# Altium schematic sheet panel2.SchDoc
size A
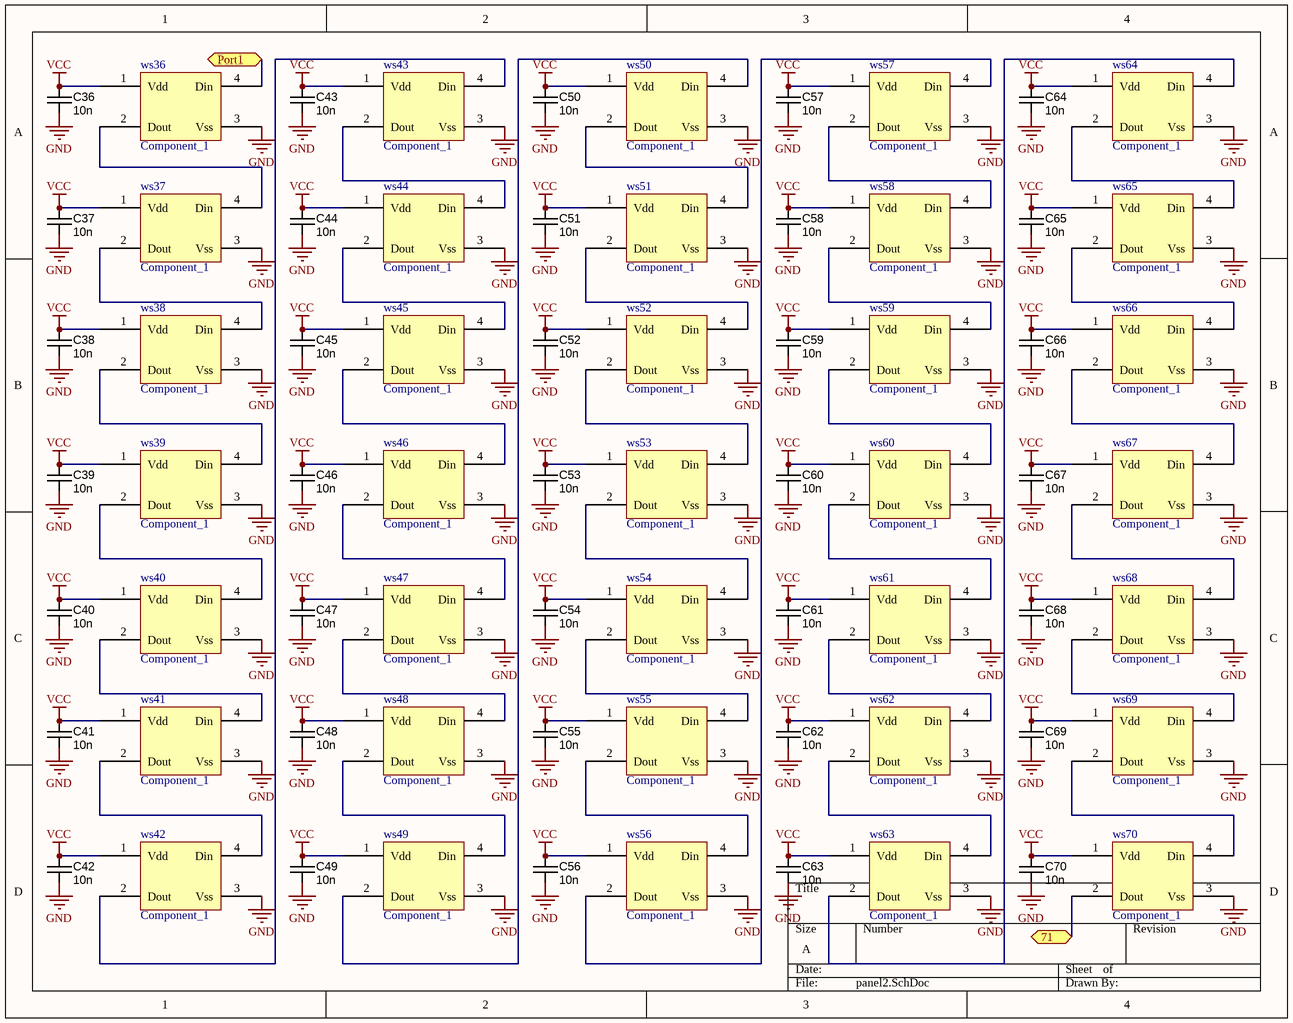
[diagram p0: panel2.SchDoc]

## Parts
C36  value 10n  [CAPC1608X90N]  (hidden comment: approved sub OK)
C37  value 10n  [CAPC1608X90N]  (hidden comment: approved sub OK)
C38  value 10n  [CAPC1608X90N]  (hidden comment: approved sub OK)
C39  value 10n  [CAPC1608X90N]  (hidden comment: approved sub OK)
C40  value 10n  [CAPC1608X90N]  (hidden comment: approved sub OK)
C41  value 10n  [CAPC1608X90N]  (hidden comment: approved sub OK)
C42  value 10n  [CAPC1608X90N]  (hidden comment: approved sub OK)
C43  value 10n  [CAPC1608X90N]  (hidden comment: approved sub OK)
C44  value 10n  [CAPC1608X90N]  (hidden comment: approved sub OK)
C45  value 10n  [CAPC1608X90N]  (hidden comment: approved sub OK)
C46  value 10n  [CAPC1608X90N]  (hidden comment: approved sub OK)
C47  value 10n  [CAPC1608X90N]  (hidden comment: approved sub OK)
C48  value 10n  [CAPC1608X90N]  (hidden comment: approved sub OK)
C49  value 10n  [CAPC1608X90N]  (hidden comment: approved sub OK)
C50  value 10n  [CAPC1608X90N]  (hidden comment: approved sub OK)
C51  value 10n  [CAPC1608X90N]  (hidden comment: approved sub OK)
C52  value 10n  [CAPC1608X90N]  (hidden comment: approved sub OK)
C53  value 10n  [CAPC1608X90N]  (hidden comment: approved sub OK)
C54  value 10n  [CAPC1608X90N]  (hidden comment: approved sub OK)
C55  value 10n  [CAPC1608X90N]  (hidden comment: approved sub OK)
C56  value 10n  [CAPC1608X90N]  (hidden comment: approved sub OK)
C57  value 10n  [CAPC1608X90N]  (hidden comment: approved sub OK)
C58  value 10n  [CAPC1608X90N]  (hidden comment: approved sub OK)
C59  value 10n  [CAPC1608X90N]  (hidden comment: approved sub OK)
C60  value 10n  [CAPC1608X90N]  (hidden comment: approved sub OK)
C61  value 10n  [CAPC1608X90N]  (hidden comment: approved sub OK)
C62  value 10n  [CAPC1608X90N]  (hidden comment: approved sub OK)
C63  value 10n  [CAPC1608X90N]  (hidden comment: approved sub OK)
C64  value 10n  [CAPC1608X90N]  (hidden comment: approved sub OK)
C65  value 10n  [CAPC1608X90N]  (hidden comment: approved sub OK)
C66  value 10n  [CAPC1608X90N]  (hidden comment: approved sub OK)
C67  value 10n  [CAPC1608X90N]  (hidden comment: approved sub OK)
C68  value 10n  [CAPC1608X90N]  (hidden comment: approved sub OK)
C69  value 10n  [CAPC1608X90N]  (hidden comment: approved sub OK)
C70  value 10n  [CAPC1608X90N]  (hidden comment: approved sub OK)
ws36  Component_1  [SOP4]
ws37  Component_1  [SOP4]
ws38  Component_1  [SOP4]
ws39  Component_1  [SOP4]
ws40  Component_1  [SOP4]
ws41  Component_1  [SOP4]
ws42  Component_1  [SOP4]
ws43  Component_1  [SOP4]
ws44  Component_1  [SOP4]
ws45  Component_1  [SOP4]
ws46  Component_1  [SOP4]
ws47  Component_1  [SOP4]
ws48  Component_1  [SOP4]
ws49  Component_1  [SOP4]
ws50  Component_1  [SOP4]
ws51  Component_1  [SOP4]
ws52  Component_1  [SOP4]
ws53  Component_1  [SOP4]
ws54  Component_1  [SOP4]
ws55  Component_1  [SOP4]
ws56  Component_1  [SOP4]
ws57  Component_1  [SOP4]
ws58  Component_1  [SOP4]
ws59  Component_1  [SOP4]
ws60  Component_1  [SOP4]
ws61  Component_1  [SOP4]
ws62  Component_1  [SOP4]
ws63  Component_1  [SOP4]
ws64  Component_1  [SOP4]
ws65  Component_1  [SOP4]
ws66  Component_1  [SOP4]
ws67  Component_1  [SOP4]
ws68  Component_1  [SOP4]
ws69  Component_1  [SOP4]
ws70  Component_1  [SOP4]

## Ports
71, Port1

## Nets
GND: C36.2 C37.2 C38.2 C39.2 C40.2 C41.2 C42.2 C43.2 C44.2 C45.2 C46.2 C47.2 C48.2 C49.2 C50.2 C51.2 C52.2 C53.2 C54.2 C55.2 C56.2 C57.2 C58.2 C59.2 C60.2 C61.2 C62.2 C63.2 C64.2 C65.2 C66.2 C67.2 C68.2 C69.2 C70.2 ws36.3(Vss) ws37.3(Vss) ws38.3(Vss) ws39.3(Vss) ws40.3(Vss) ws41.3(Vss) ws42.3(Vss) ws43.3(Vss) ws44.3(Vss) ws45.3(Vss) ws46.3(Vss) ws47.3(Vss) ws48.3(Vss) ws49.3(Vss) ws50.3(Vss) ws51.3(Vss) ws52.3(Vss) ws53.3(Vss) ws54.3(Vss) ws55.3(Vss) ws56.3(Vss) ws57.3(Vss) ws58.3(Vss) ws59.3(Vss) ws60.3(Vss) ws61.3(Vss) ws62.3(Vss) ws63.3(Vss) ws64.3(Vss) ws65.3(Vss) ws66.3(Vss) ws67.3(Vss) ws68.3(Vss) ws69.3(Vss) ws70.3(Vss)
VCC: C36.1 C37.1 C38.1 C39.1 C40.1 C41.1 C42.1 C43.1 C44.1 C45.1 C46.1 C47.1 C48.1 C49.1 C50.1 C51.1 C52.1 C53.1 C54.1 C55.1 C56.1 C57.1 C58.1 C59.1 C60.1 C61.1 C62.1 C63.1 C64.1 C65.1 C66.1 C67.1 C68.1 C69.1 C70.1 ws36.1(Vdd) ws37.1(Vdd) ws38.1(Vdd) ws39.1(Vdd) ws40.1(Vdd) ws41.1(Vdd) ws42.1(Vdd) ws43.1(Vdd) ws44.1(Vdd) ws45.1(Vdd) ws46.1(Vdd) ws47.1(Vdd) ws48.1(Vdd) ws49.1(Vdd) ws50.1(Vdd) ws51.1(Vdd) ws52.1(Vdd) ws53.1(Vdd) ws54.1(Vdd) ws55.1(Vdd) ws56.1(Vdd) ws57.1(Vdd) ws58.1(Vdd) ws59.1(Vdd) ws60.1(Vdd) ws61.1(Vdd) ws62.1(Vdd) ws63.1(Vdd) ws64.1(Vdd) ws65.1(Vdd) ws66.1(Vdd) ws67.1(Vdd) ws68.1(Vdd) ws69.1(Vdd) ws70.1(Vdd)
71: ws70.2(Dout) ; port 71
Port1: ws36.4(Din) ; port Port1
Netws36_2: ws36.2(Dout) ws37.4(Din)
Netws37_2: ws37.2(Dout) ws38.4(Din)
Netws38_2: ws38.2(Dout) ws39.4(Din)
Netws39_2: ws39.2(Dout) ws40.4(Din)
Netws40_2: ws40.2(Dout) ws41.4(Din)
Netws41_2: ws41.2(Dout) ws42.4(Din)
Netws42_2: ws42.2(Dout) ws43.4(Din)
Netws43_2: ws43.2(Dout) ws44.4(Din)
Netws44_2: ws44.2(Dout) ws45.4(Din)
Netws45_2: ws45.2(Dout) ws46.4(Din)
Netws46_2: ws46.2(Dout) ws47.4(Din)
Netws47_2: ws47.2(Dout) ws48.4(Din)
Netws48_2: ws48.2(Dout) ws49.4(Din)
Netws49_2: ws49.2(Dout) ws50.4(Din)
Netws50_2: ws50.2(Dout) ws51.4(Din)
Netws51_2: ws51.2(Dout) ws52.4(Din)
Netws52_2: ws52.2(Dout) ws53.4(Din)
Netws53_2: ws53.2(Dout) ws54.4(Din)
Netws54_2: ws54.2(Dout) ws55.4(Din)
Netws55_2: ws55.2(Dout) ws56.4(Din)
Netws56_2: ws56.2(Dout) ws57.4(Din)
Netws57_2: ws57.2(Dout) ws58.4(Din)
Netws58_2: ws58.2(Dout) ws59.4(Din)
Netws59_2: ws59.2(Dout) ws60.4(Din)
Netws60_2: ws60.2(Dout) ws61.4(Din)
Netws61_2: ws61.2(Dout) ws62.4(Din)
Netws62_2: ws62.2(Dout) ws63.4(Din)
Netws63_2: ws63.2(Dout) ws64.4(Din)
Netws64_2: ws64.2(Dout) ws65.4(Din)
Netws65_2: ws65.2(Dout) ws66.4(Din)
Netws66_2: ws66.2(Dout) ws67.4(Din)
Netws67_2: ws67.2(Dout) ws68.4(Din)
Netws68_2: ws68.2(Dout) ws69.4(Din)
Netws69_2: ws69.2(Dout) ws70.4(Din)

## Library data of the parts
C36-C70 = CAPC_10n_0603_X7R_100V_10%: Capacitor SMD Cer 10nF 10% 100V X7R 0603; Manufacturer: Murata Electronics North America; Manufacturer Part Number: GCM188R72A103KA37D; Ratings: 100V; X7R; Material: ceramic; SCDType: undef; Package / Case: 0603 (1608 metric); Tolerance: ±10%; Supplier 1: Digi-Key; Supplier Part Number 1: 490-4781-1-ND